# EasyEDA Pro project PCB_飞机接收机.eprj

# Schematic Sheet_1
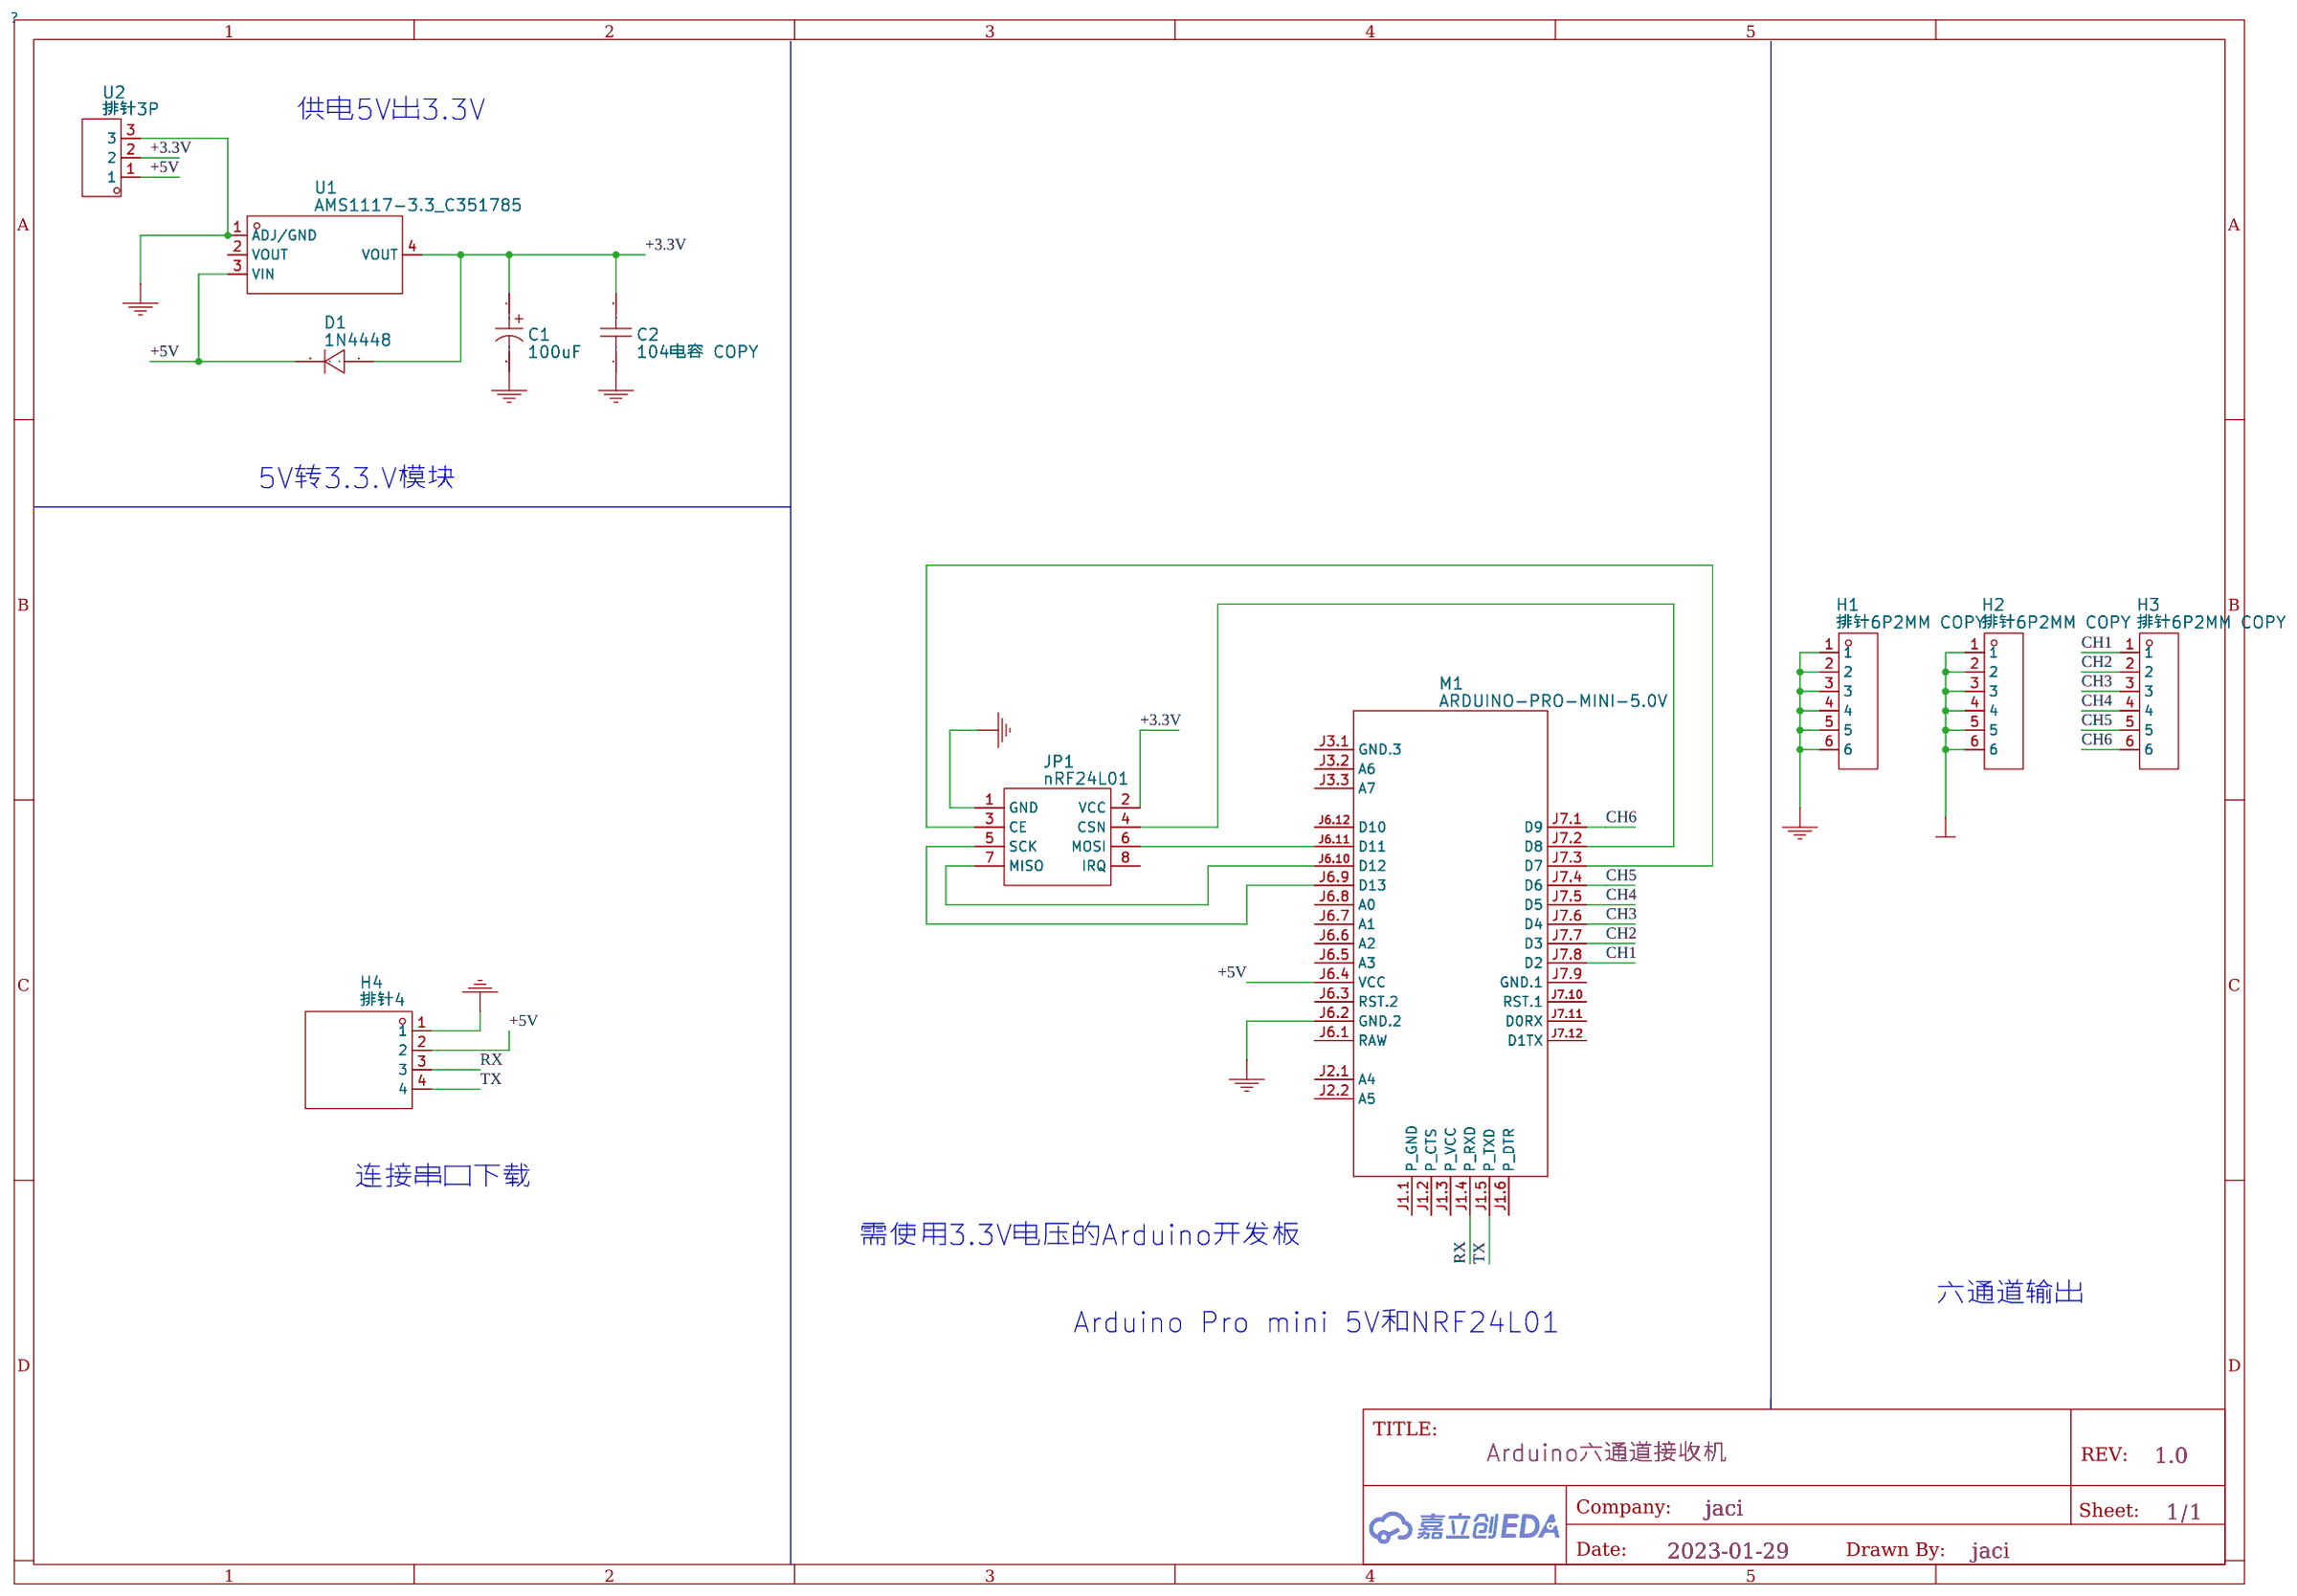
[diagram p0: schematic sheet]

## Parts
C1  100uF
C2  104电容 COPY
D1  1N4448
H1  排针6P2MM COPY
H2  排针6P2MM COPY
H3  排针6P2MM COPY
H4  排针4
JP1  nRF24L01
M1  ARDUINO-PRO-MINI-5.0V
U1  AMS1117-3.3_C351785
U2  排针3P

## Library data of the parts
C1 = ECA1HHG101: Supplier: LCSC; Supplier Part: C713160; Manufacturer: PANASONIC(松下); JLCPCB Part Class: ExtendedPart
C2 = 104电容 COPY
D1 = 1N4448: Supplier: LCSC; Manufacturer: SEMTECH; image: //image.lceda.cn/szlcsc/C54037.jpg; Supplier Part: C54037
H1-H3 = 排针6P2MM COPY
H4 = A2541WV-10P: Supplier: LCSC; Supplier Part: C225485; Manufacturer: ChangjiangConnectors; JLCPCB Part Class: ExtendedPart
JP1 = nRF24L01: BOM名称: 4*2P接插件; 学习资源: www.ooocke.com; 版权归属: 源创客
M1 = ARDUINO-PRO-MINI-5.0V: ArduinoProMini
U1 = AMS1117-3.3: Supplier: LCSC; Supplier Part: C351785; Manufacturer: PUOLOP(迪浦); JLCPCB Part Class: ExtendedPart
U2 = 排针3P

## Nets
+3.3V: C1.1 C2.2 D1.1(A) JP1.2(VCC) U1.4(VOUT) U2.2
+5V: D1.2(K) H2.1 H2.2 H2.3 H2.4 H2.5 H2.6 H4.2 M1.J6.4(VCC) U1.3(VIN) U2.1
GND: C1.2 C2.1 H1.1 H1.2 H1.3 H1.4 H1.5 H1.6 H4.1 JP1.1(GND) M1.J6.2(GND.2) U1.1(ADJ/GND) U2.3
CH1: H3.1 M1.J7.8(D2)
CH2: H3.2 M1.J7.7(D3)
CH3: H3.3 M1.J7.6(D4)
CH4: H3.4 M1.J7.5(D5)
CH5: H3.5 M1.J7.4(D6)
CH6: H3.6 M1.J7.1(D9)
RX: H4.3 M1.J1.4(P_RXD)
TX: H4.4 M1.J1.5(P_TXD)
Net-(JP1-3): JP1.3(CE) M1.J7.3(D7)
Net-(JP1-4): JP1.4(CSN) M1.J7.2(D8)
Net-(JP1-5): JP1.5(SCK) M1.J6.9(D13)
Net-(JP1-6): JP1.6(MOSI) M1.J6.11(D11)
Net-(JP1-7): JP1.7(MISO) M1.J6.10(D12)

Not connected (* = marked no-connect by the designer): JP1 8(IRQ); M1 J1.1(P_GND) J1.2(P_CTS) J1.3(P_VCC) J1.6(P_DTR) J2.1(A4) J2.2(A5) J3.1(GND.3) J3.2(A6) J3.3(A7) J6.1(RAW) J6.3(RST.2) J6.5(A3) J6.6(A2) J6.7(A1) J6.8(A0) J6.12(D10) J7.9(GND.1) J7.10(RST.1) J7.11(D0RX) J7.12(D1TX); U1 2(VOUT)

## Notes on the sheet
- 供电5V出3.3V
- 5V转3.3.V模块
- 连接串口下载
- 需使用3.3V电压的Arduino开发板
- 六通道输出
- Arduino Pro mini 5V和NRF24L01

# Board PCB_飞机接收机
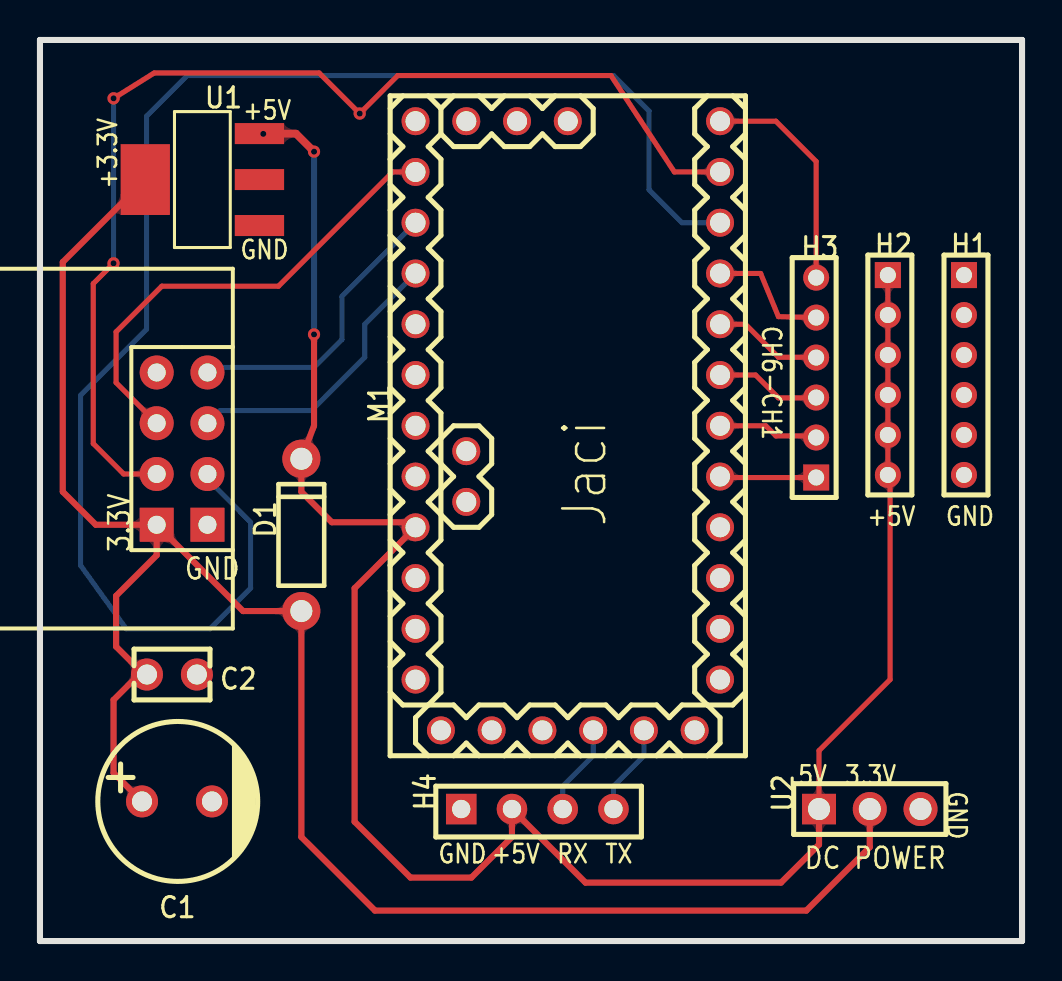
[diagram p1: board, top side]
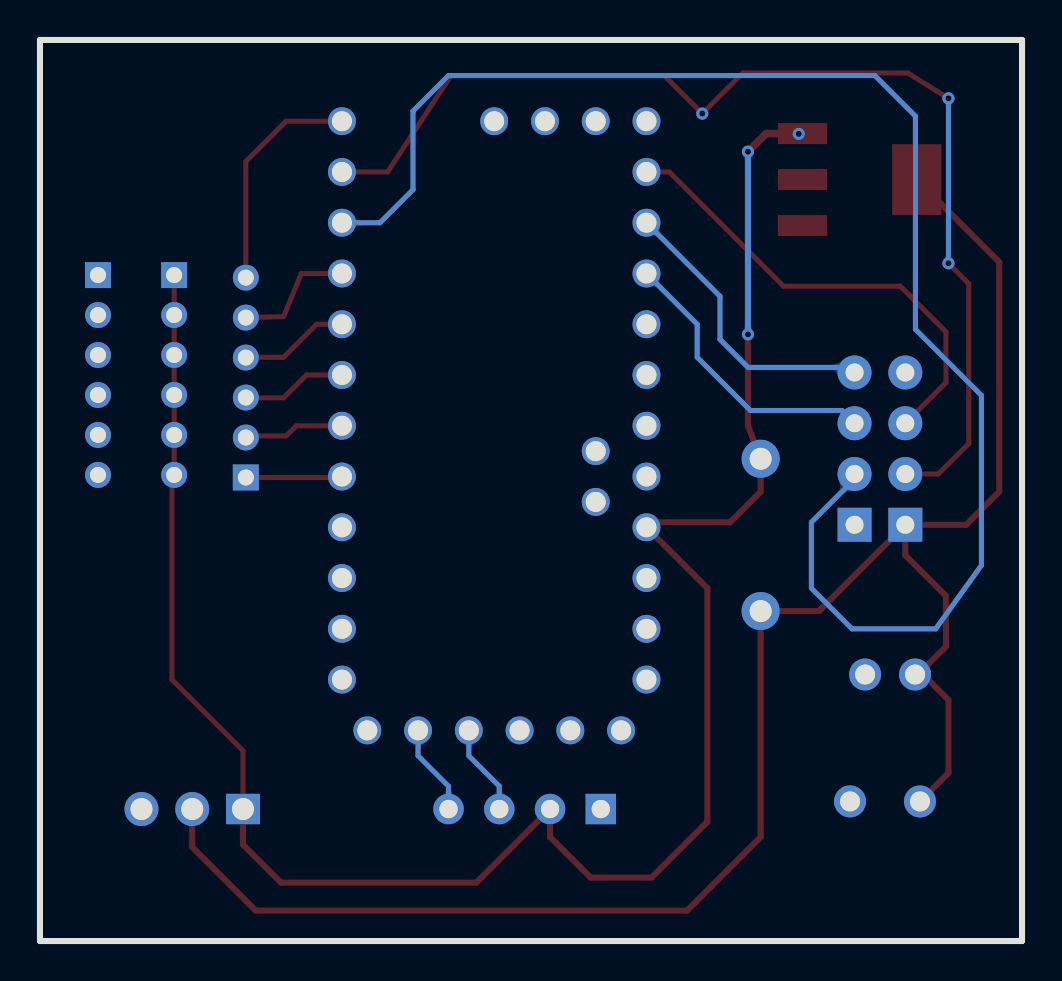
[diagram p2: board, bottom side, seen from below]

Outline 49.15 x 45.08 mm; copper layers: Top Layer, Bottom Layer. Coordinates in mm from the lower left corner of the outline.
Outline path: 0,45.08 0,0 49.15,0 49.15,45.08 0,45.08
Stack: Top Layer 0.035mm / Dielectric1 1.51mm FR4 er 4.5 / Bottom Layer 0.035mm

## Design rules (mm)
spacing Default (default): track to track 0.152, other pairs 0 to 0.152
track width Default (default): min 0.254, default 0.254, max 25.4
differential pair differentialPair (default): width min 0.127, default 0.254, max 2.54; gap min 0.152, default 0.152
via Default (default): diameter min 0.61, default 0.61, max 100.025; hole min 0.305, default 0.305, max 59.995
net GND uses gge6092

## Placement (name value [footprint] x y rotation side)
C1  100uF  [CAP-TH_BD8.0-P3.50-D0.6-FD]  6.86 6.98 0 top
C2  104电容 COPY  [104电容_L3.8-W2.5-P2.50-D0.51]  6.6 13.33 180 top
D1  1N4448  [DO-35]  13.08 20.32 90 top
H1  排针6P2MM COPY  [排针6P 间距2.0MM]  47.24 28.32 90 top
H2  排针6P2MM COPY  [排针6P 间距2.0MM]  43.43 28.32 90 top
H3  排针6P2MM COPY  [排针6P 间距2.0MM]  37.85 28.19 270 top
H4  -  [排针4]  29.97 6.6 90 top
JP1  nRF24L01  [NRF24L01]  5.84 24.64 90 top
M1  ARDUINO-PRO-MINI-5.0V  [ARDUINO-PRO-MINI]  26.42 25.78 90 top
U1  AMS1117-3.3_C351785  [SOT-223_L6.5-W3.5-P2.30-LS7.0-BR]  8.13 38.1 0 top
U2  -  [排针3P]  41.53 6.6 0 top

## Footprints (pads in the part's own frame, mm; a bottom-side part is the same pattern mirrored in y, then rotated)
104电容_L3.8-W2.5-P2.50-D0.51
  round 1.6 hole 1: 1(-1.25,0) 2(1.25,0)
ARDUINO-PRO-MINI
  round 1.399 hole 1.001: J1.1(-15.24,6.35) J1.2(-15.24,3.81) J1.3(-15.24,1.27) J1.4(-15.24,-1.27) J1.5(-15.24,-3.81) J1.6(-15.24,-6.35) J2.1(-1.27,5.08) J2.2(-3.81,5.08) J3.1(15.24,0) J3.2(15.24,2.54) J3.3(15.24,5.08) J6.1(-12.7,7.62) J6.2(-10.16,7.62) J6.3(-7.62,7.62) J6.4(-5.08,7.62) J6.5(-2.54,7.62) J6.6(0,7.62) J6.7(2.54,7.62) J6.8(5.08,7.62) J6.9(7.62,7.62) J6.10(10.16,7.62) J6.11(12.7,7.62) J6.12(15.24,7.62) J7.1(15.24,-7.62) J7.2(12.7,-7.62) J7.3(10.16,-7.62) J7.4(7.62,-7.62) J7.5(5.08,-7.62) J7.6(2.54,-7.62) J7.7(0,-7.62) J7.8(-2.54,-7.62) J7.9(-5.08,-7.62) J7.10(-7.62,-7.62) J7.11(-10.16,-7.62) J7.12(-12.7,-7.62)
CAP-TH_BD8.0-P3.50-D0.6-FD
  round 1.6 hole 1: 1(-1.75,0) 2(1.75,0)
DO-35
  round 1.905 hole 1.1: 1(-3.81,0) 2(3.81,0)
NRF24L01
  rect 1.7x1.7 hole 0.9: 1(-3.81,-2.54) 2(-3.81,0)
  round 1.7 hole 0.9: 3(-1.27,-2.54) 4(-1.27,0) 5(1.27,-2.54) 6(1.27,0) 7(3.81,-2.54) 8(3.81,0)
SOT-223_L6.5-W3.5-P2.30-LS7.0-BR
  rect 2.465x1.05 smd: 1(2.857,-2.3) 2(2.857,0) 3(2.857,2.3)
  rect 2.465x3.54 smd: 4(-2.857,0)
排针3P
  rect 1.7x1.524 hole 1.1: 1(-2.54,0)
  round 1.7 hole 1.1: 2(0,0) 3(2.54,0)
排针4
  rect 1.524x1.524 hole 0.914: 1(0,8.89)
  round 1.524 hole 0.914: 2(0,6.35) 3(0,3.81) 4(0,1.27)
排针6P 间距2.0MM
  rect 1.3x1.3 hole 0.8: 1(5,1)
  round 1.3 hole 0.8: 2(3,1) 3(1,1) 4(-1,1) 5(-3,1) 6(-5,1)

## Nets
+3.3V: C1.1 C2.2 D1.1 JP1.2 U1.4 U2.2
+5V: D1.2 H2.1 H2.2 H2.3 H2.4 H2.5 H2.6 H4.2 M1.J6.4 U1.3 U2.1
GND: C1.2 C2.1 H1.1 H1.2 H1.3 H1.4 H1.5 H1.6 H4.1 JP1.1 M1.J6.2 U1.1 U2.3
CH1: H3.1 M1.J7.8
CH2: H3.2 M1.J7.7
CH3: H3.3 M1.J7.6
CH4: H3.4 M1.J7.5
CH5: H3.5 M1.J7.4
CH6: H3.6 M1.J7.1
JP1_8: JP1.8
M1_J1.1: M1.J1.1
M1_J1.2: M1.J1.2
M1_J1.3: M1.J1.3
M1_J1.6: M1.J1.6
M1_J2.1: M1.J2.1
M1_J2.2: M1.J2.2
M1_J3.1: M1.J3.1
M1_J3.2: M1.J3.2
M1_J3.3: M1.J3.3
M1_J6.1: M1.J6.1
M1_J6.3: M1.J6.3
M1_J6.5: M1.J6.5
M1_J6.6: M1.J6.6
M1_J6.7: M1.J6.7
M1_J6.8: M1.J6.8
M1_J6.9: JP1.5 M1.J6.9
M1_J6.10: JP1.7 M1.J6.10
M1_J6.11: JP1.6 M1.J6.11
M1_J6.12: M1.J6.12
M1_J7.2: JP1.4 M1.J7.2
M1_J7.3: JP1.3 M1.J7.3
M1_J7.9: M1.J7.9
M1_J7.10: M1.J7.10
M1_J7.11: M1.J7.11
M1_J7.12: M1.J7.12
RX: H4.3 M1.J1.4
TX: H4.4 M1.J1.5
U1_2: U1.2

## Via types
v1: diameter 0.61, hole 0.305, Top Layer to Bottom Layer, 6 vias

## Routing (per net, layer and track width the routed paths; a pad name or vN(x,y) marks a point on that pad's centre or on a via; arc(x,y) is an arc through that point)
+3.3V: length 93.2
  Top Layer w0.305: JP1.2 10.16,16.51 D1.1 13.08,5.21 16.76,1.52 38.35,1.52 41.53,4.7 U2.2 ; JP1.2 5.84,19.3 3.81,17.27 3.81,14.73 5.21,13.33 5.35,13.33 ; JP1.2 2.79,20.83 1.14,22.48 1.14,33.97 U1.4 ; C2.2 4.95,13.33 3.68,12.06 3.68,8.41 C1.1
+5V: length 101.7
  Top Layer w0.254: H2.6 H2.5 H2.4 H2.3 H2.2 42.43,33.32 ; 42.43,23.32 42.55,23.21 42.55,13.08 38.99,9.53 U2.1
  Top Layer w0.305: U2.1 38.99,4.83 37.08,2.92 27.31,2.92 H4.2 23.62,5.21 21.59,3.17 18.54,3.17 15.75,5.97 15.75,17.65 M1.J6.4 18.54,20.95 14.61,20.95 13.08,22.48 D1.2 13.72,25.78 v1(13.72,30.35)
  Top Layer w0.381: U1.3 12.81,40.4 v1(13.72,39.5)
  Bottom Layer w0.305: v1(13.72,30.35) v1(13.72,39.5)
  vias: v1(11.18,40.39)
CH1: length 4.8
  Top Layer w0.254: M1.J7.8 34.08,23.19 38.85,23.19
CH2: length 5.1
  Top Layer w0.254: H3.2 38.77,25.27 36.83,25.27 36.32,25.78 M1.J7.7
CH3: length 5.3
  Top Layer w0.254: M1.J7.6 35.81,28.32 36.96,27.18 38.83,27.18 H3.3
CH4: length 5.5
  Top Layer w0.254: M1.J7.5 35.31,30.86 36.96,29.21 38.83,29.21 H3.4
CH5: length 6.3
  Top Layer w0.254: M1.J7.4 36.07,33.4 36.96,31.24 H3.5
CH6: length 11.5
  Top Layer w0.254: M1.J7.1 36.83,41.02 38.85,39 H3.6
M1_J6.9: length 14.5
  Bottom Layer w0.254: M1.J6.9 16.26,30.86 16.26,29.21 13.59,26.54 9.02,26.54 JP1.5
M1_J6.10: length 14.8
  Bottom Layer w0.254: M1.J6.10 15.11,32.26 15.11,30.1 13.72,28.7 8.64,28.7 JP1.7
M1_J6.11: length 23.7
  Top Layer w0.254: JP1.6 3.81,27.94 3.81,30.48 6.1,32.77 11.94,32.77 17.65,38.48 M1.J6.11
M1_J7.2: length 56.4
  Top Layer w0.254: JP1.4 4.19,23.37 2.67,24.89 2.67,32.89 v1(3.68,33.91) ; M1.J7.2 31.75,38.48 28.58,43.31 17.91,43.31 v1(16,41.4) 13.97,43.43 5.72,43.43 v1(3.68,42.16)
  Bottom Layer w0.254: v1(3.68,33.91) v1(3.68,42.16)
M1_J7.3: length 76.3
  Bottom Layer w0.254: JP1.3 8.38,23.11 10.54,20.95 10.54,17.65 8.51,15.62 4.32,15.62 2.03,18.8 2.03,27.3 5.33,30.61 5.33,41.28 7.37,43.31 28.7,43.31 30.48,41.53 30.48,37.59 32.13,35.94 M1.J7.3
RX: length 4.6
  Bottom Layer w0.254: H4.3 26.16,7.75 27.69,9.27 M1.J1.4
TX: length 4.6
  Bottom Layer w0.254: M1.J1.5 30.23,9.27 28.7,7.75 H4.4

## Copper pours and planes (outline as drawn; the poured copper is in the pictures)
GND on Top Layer: -2.29,49.02 53.34,49.02 53.34,-2.67 -2.29,-2.67
GND on Bottom Layer: -13.97,55.63 61.34,55.63 61.34,-11.81 -13.97,-11.81

Small or netless copper shapes (teardrops, artwork), in the pictures only: 53 on Top Layer, 14 on Bottom Layer

## Text on the board
Top Silkscreen Layer: GND | +5V | RX | TX | 5V | 3.3V | +3.3V | CH6-CH1 | DC POWER | Jaci
